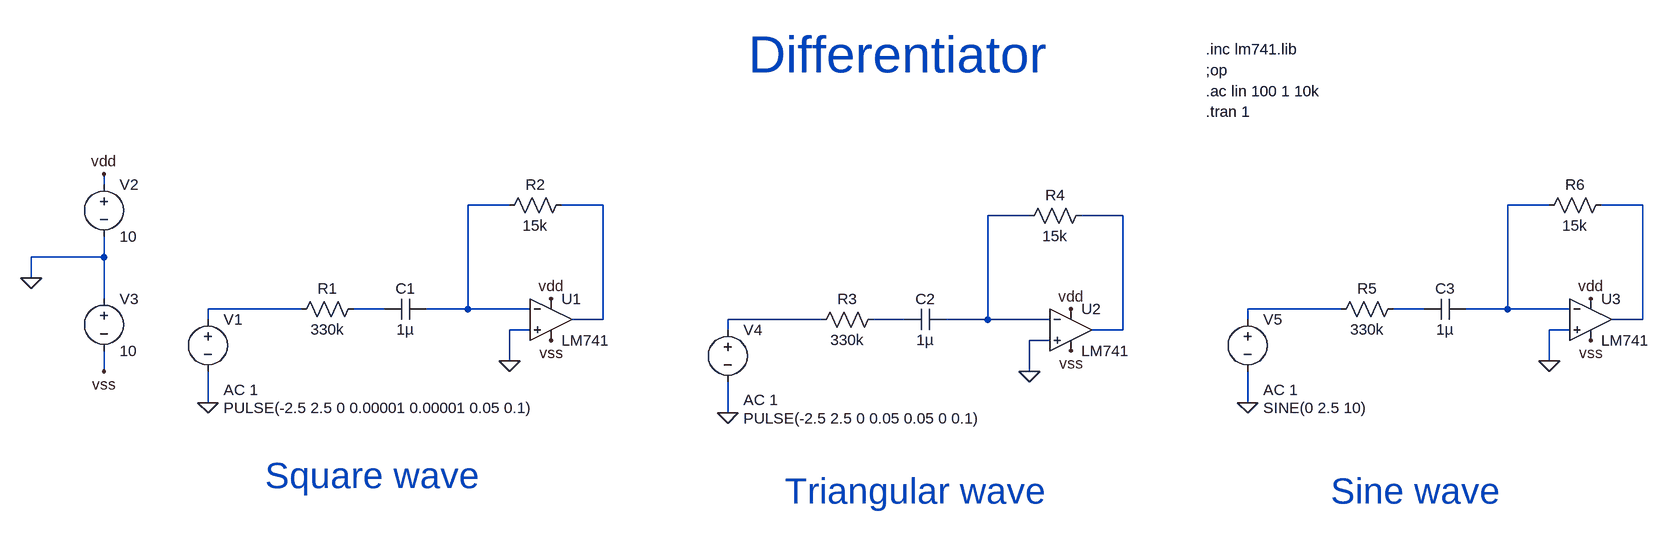
[diagram p0: schematic differentiator.asc]
differentiator.asc, the LTspice schematic file:
Version 4
SHEET 1 2096 680
WIRE -288 -48 -288 -64
WIRE 336 -16 272 -16
WIRE 480 -16 416 -16
WIRE 1936 -16 1872 -16
WIRE 2080 -16 2016 -16
WIRE 1136 0 1072 0
WIRE 1280 0 1216 0
WIRE -288 64 -288 32
WIRE -288 64 -400 64
WIRE -400 96 -400 64
WIRE -288 128 -288 64
WIRE 16 144 -128 144
WIRE 144 144 96 144
WIRE 272 144 272 -16
WIRE 272 144 208 144
WIRE 368 144 272 144
WIRE 1616 144 1472 144
WIRE 1744 144 1696 144
WIRE 1872 144 1872 -16
WIRE 1872 144 1808 144
WIRE 1968 144 1872 144
WIRE -128 160 -128 144
WIRE 480 160 480 -16
WIRE 480 160 432 160
WIRE 816 160 672 160
WIRE 944 160 896 160
WIRE 1072 160 1072 0
WIRE 1072 160 1008 160
WIRE 1168 160 1072 160
WIRE 1472 160 1472 144
WIRE 2080 160 2080 -16
WIRE 2080 160 2032 160
WIRE 368 176 336 176
WIRE 672 176 672 160
WIRE 1280 176 1280 0
WIRE 1280 176 1232 176
WIRE 1968 176 1936 176
WIRE 1168 192 1136 192
WIRE 336 224 336 176
WIRE 1936 224 1936 176
WIRE -288 240 -288 208
WIRE 1136 240 1136 192
WIRE -128 288 -128 240
WIRE 1472 288 1472 240
WIRE 672 304 672 256
FLAG -128 288 0
FLAG 336 224 0
FLAG -400 96 0
FLAG 400 128 vdd
FLAG -288 -64 vdd
FLAG -288 240 vss
FLAG 400 192 vss
FLAG 672 304 0
FLAG 1136 240 0
FLAG 1200 144 vdd
FLAG 1200 208 vss
FLAG 1472 288 0
FLAG 1936 224 0
FLAG 2000 128 vdd
FLAG 2000 192 vss
SYMBOL res 112 128 R90
WINDOW 0 0 56 VBottom 2
WINDOW 3 32 56 VTop 2
SYMATTR InstName R1
SYMATTR Value 330k
SYMBOL res 432 -32 R90
WINDOW 0 0 56 VBottom 2
WINDOW 3 32 56 VTop 2
SYMATTR InstName R2
SYMATTR Value 15k
SYMBOL cap 208 128 R90
WINDOW 0 0 32 VBottom 2
WINDOW 3 32 32 VTop 2
SYMATTR InstName C1
SYMATTR Value 1µ
SYMBOL OpAmps\\opamp2 400 96 R0
SYMATTR InstName U1
SYMATTR Value LM741
SYMBOL voltage -128 144 R0
WINDOW 3 24 152 Left 2
WINDOW 123 24 124 Left 2
WINDOW 39 0 0 Left 0
SYMATTR Value PULSE(-2.5 2.5 0 0.00001 0.00001 0.05 0.1)
SYMATTR Value2 AC 1
SYMATTR InstName V1
SYMBOL voltage -288 -64 R0
WINDOW 123 0 0 Left 0
WINDOW 39 0 0 Left 0
SYMATTR InstName V2
SYMATTR Value 10
SYMBOL voltage -288 112 R0
WINDOW 123 0 0 Left 0
WINDOW 39 0 0 Left 0
SYMATTR InstName V3
SYMATTR Value 10
SYMBOL res 912 144 R90
WINDOW 0 0 56 VBottom 2
WINDOW 3 32 56 VTop 2
SYMATTR InstName R3
SYMATTR Value 330k
SYMBOL res 1232 -16 R90
WINDOW 0 0 56 VBottom 2
WINDOW 3 32 56 VTop 2
SYMATTR InstName R4
SYMATTR Value 15k
SYMBOL cap 1008 144 R90
WINDOW 0 0 32 VBottom 2
WINDOW 3 32 32 VTop 2
SYMATTR InstName C2
SYMATTR Value 1µ
SYMBOL OpAmps\\opamp2 1200 112 R0
SYMATTR InstName U2
SYMATTR Value LM741
SYMBOL voltage 672 160 R0
WINDOW 3 24 152 Left 2
WINDOW 123 24 124 Left 2
WINDOW 39 0 0 Left 0
SYMATTR Value PULSE(-2.5 2.5 0 0.05 0.05 0 0.1)
SYMATTR Value2 AC 1
SYMATTR InstName V4
SYMBOL res 1712 128 R90
WINDOW 0 0 56 VBottom 2
WINDOW 3 32 56 VTop 2
SYMATTR InstName R5
SYMATTR Value 330k
SYMBOL res 2032 -32 R90
WINDOW 0 0 56 VBottom 2
WINDOW 3 32 56 VTop 2
SYMATTR InstName R6
SYMATTR Value 15k
SYMBOL cap 1808 128 R90
WINDOW 0 0 32 VBottom 2
WINDOW 3 32 32 VTop 2
SYMATTR InstName C3
SYMATTR Value 1µ
SYMBOL OpAmps\\opamp2 2000 96 R0
SYMATTR InstName U3
SYMATTR Value LM741
SYMBOL voltage 1472 144 R0
WINDOW 3 24 152 Left 2
WINDOW 123 24 124 Left 2
WINDOW 39 0 0 Left 0
SYMATTR Value SINE(0 2.5 10)
SYMATTR Value2 AC 1
SYMATTR InstName V5
TEXT 1408 -256 Left 2 !.inc lm741.lib
TEXT 1408 -224 Left 2 !;op
TEXT 1408 -192 Left 2 !.ac lin 100 1 10k
TEXT 1408 -160 Left 2 !.tran 1
TEXT 704 -248 Left 6 ;Differentiator
TEXT -40 400 Left 5 ;Square wave
TEXT 760 424 Left 5 ;Triangular wave
TEXT 1600 424 Left 5 ;Sine wave

The netlist it stands for:
* differentiator.asc
R1 N008 N007 330k
R2 N002 N001 15k
C1 N001 N008 1µ
XU1 0 N001 vdd vss N002 LM741  ; pins In+ In- V+ V- OUT
V1 N007 0 PULSE(-2.5 2.5 0 0.00001 0.00001 0.05 0.1) AC 1
V2 vdd 0 10
V3 0 vss 10
R3 N012 N011 330k
R4 N006 N005 15k
C2 N005 N012 1µ
XU2 0 N005 vdd vss N006 LM741  ; pins In+ In- V+ V- OUT
V4 N011 0 PULSE(-2.5 2.5 0 0.05 0.05 0 0.1) AC 1
R5 N010 N009 330k
R6 N004 N003 15k
C3 N003 N010 1µ
XU3 0 N003 vdd vss N004 LM741  ; pins In+ In- V+ V- OUT
V5 N009 0 SINE(0 2.5 10) AC 1
.inc lm741.lib
;op
.ac lin 100 1 10k
.tran 1
* Differentiator
* Square wave
* Triangular wave
* Sine wave
.backanno
.end